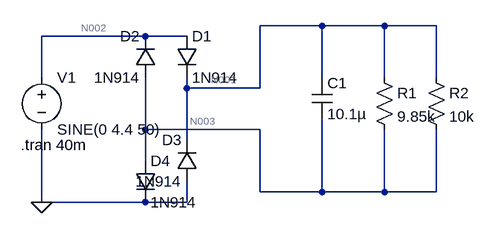
[diagram p0: schematic Draft1.asc]
Draft1.asc, the LTspice schematic file:
Version 4
SHEET 1 880 680
WIRE 560 64 464 64
WIRE 656 64 560 64
WIRE 736 64 656 64
WIRE 288 80 128 80
WIRE 352 80 288 80
WIRE 128 144 128 80
WIRE 560 144 560 64
WIRE 656 144 656 64
WIRE 736 144 736 64
WIRE 352 160 352 144
WIRE 464 160 464 64
WIRE 464 160 352 160
WIRE 288 224 288 144
WIRE 464 224 288 224
WIRE 352 240 352 160
WIRE 288 272 288 224
WIRE 464 320 464 224
WIRE 560 320 560 208
WIRE 560 320 464 320
WIRE 656 320 656 224
WIRE 656 320 560 320
WIRE 736 320 736 224
WIRE 736 320 656 320
WIRE 128 336 128 224
WIRE 288 336 128 336
WIRE 352 336 352 304
WIRE 352 336 288 336
FLAG 128 336 0
SYMBOL voltage 128 128 R0
WINDOW 123 0 0 Left 2
WINDOW 39 0 0 Left 2
SYMATTR InstName V1
SYMATTR Value SINE(0 4.4 50)
SYMBOL diode 336 80 R0
SYMATTR InstName D1
SYMATTR Value 1N914
SYMBOL diode 304 144 R180
WINDOW 0 24 64 Left 2
WINDOW 3 24 0 Left 2
SYMATTR InstName D2
SYMATTR Value 1N914
SYMBOL diode 368 304 R180
WINDOW 0 24 64 Left 2
WINDOW 3 24 0 Left 2
SYMATTR InstName D3
SYMATTR Value 1N914
SYMBOL diode 272 272 R0
SYMATTR InstName D4
SYMATTR Value 1N914
SYMBOL res 640 128 R0
SYMATTR InstName R1
SYMATTR Value 9.85k
SYMBOL cap 544 144 R0
SYMATTR InstName C1
SYMATTR Value 10.1µ
SYMBOL res 720 128 R0
SYMATTR InstName R2
SYMATTR Value 10k
TEXT 96 248 Left 2 !.tran 40m

The netlist it stands for:
* Draft1.asc
V1 N002 0 SINE(0 4.4 50)
D1 N002 N001 1N914
D2 N003 N002 1N914
D3 0 N001 1N914
D4 N003 0 1N914
R1 N001 N003 9.85k
C1 N001 N003 10.1µ
R2 N001 N003 10k
.model D D
.lib standard.dio
.tran 40m
.backanno
.end

* Results of the author's LTspice run, read from the files saved beside the schematic
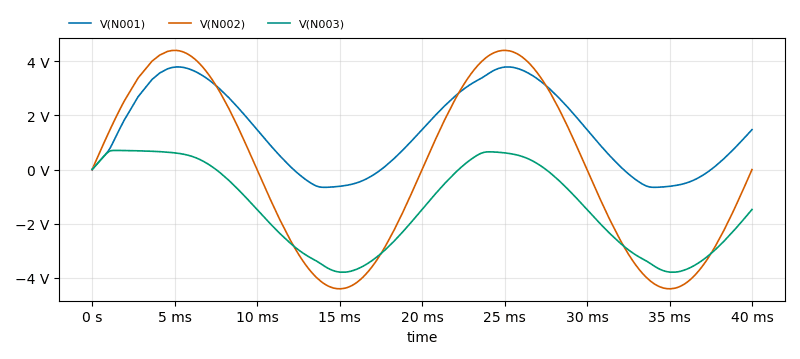
[diagram p1: Transient Analysis of Draft1.asc, plotted from the saved traces]
* Transient Analysis, 1 run:
*   V(N001): min -655.3 mV, max 3.789 V, average 1.411 V, rms 2.094 V, last 1.473 V
*   V(N002): min -4.399 V, max 4.399 V, average -892.8 µV, rms 3.114 V, last 0 V
*   V(N003): min -3.788 V, max 706.6 mV, average -1.412 V, rms 2.157 V, last -1.473 V